# EAGLE design opamp_cc_load (EAGLE 7.6.0)
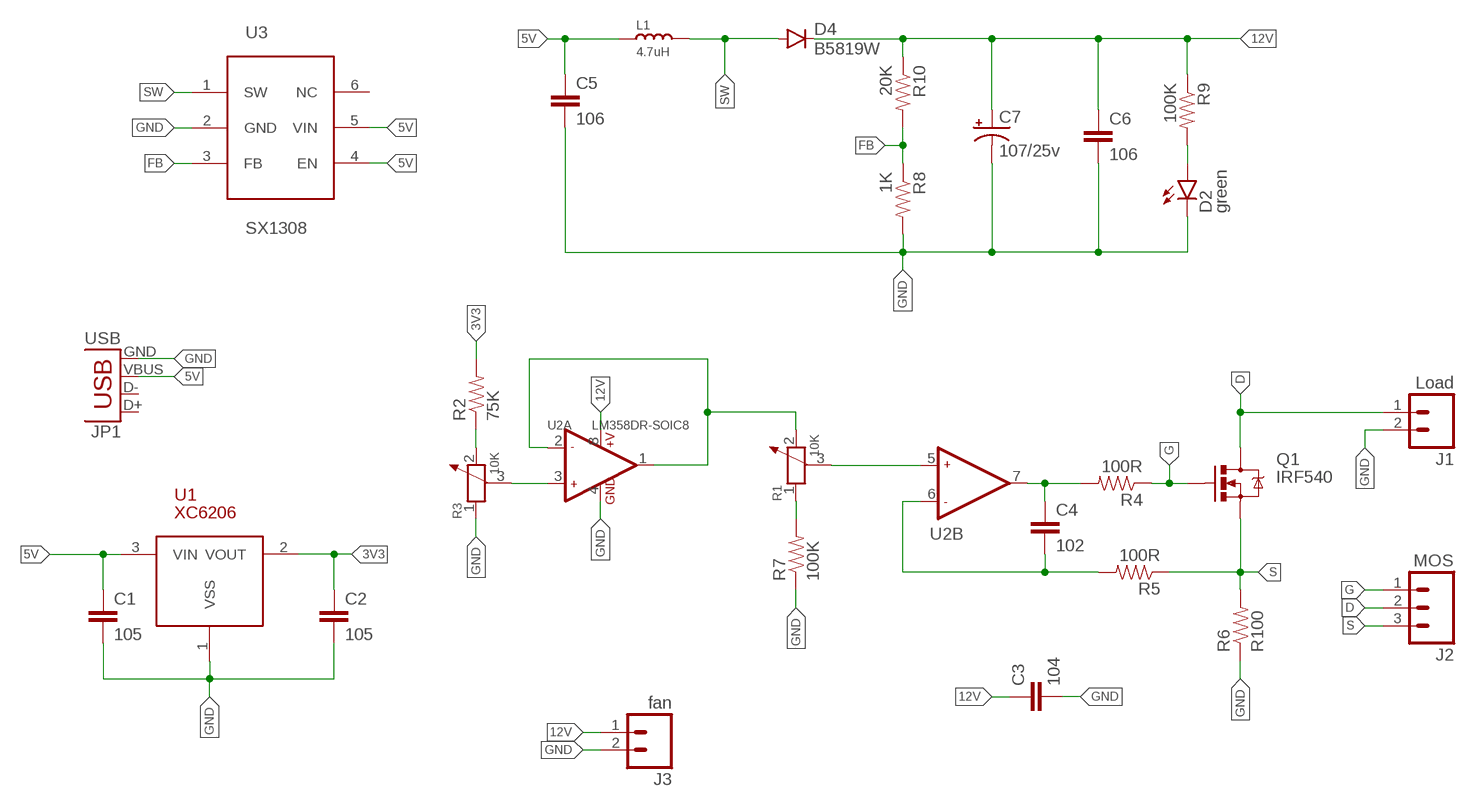
[diagram p0: schematic, sheet 1]

## Parts
C1  105  CAP0603-CAP  [0603-CAP]
C2  105  CAP0603-CAP  [0603-CAP]
C3  104  CAP0603-CAP  [0603-CAP]
C4  102  CAP0603-CAP  [0603-CAP]
C5  106  CAP1206  [1206]
C6  106  CAP1206  [1206]
C7  107/25v  CAP_POLPTH1  [CPOL-RADIAL-100UF-25V]
D2  green  LED-SEEED-0603  [LED-0603-SEEED]
D4  B5819W  DIODESOD123  [SOD-123]
J1  Load  M025MM  [SCREWTERMINAL-5MM-2]
J2  MOS  M03-SCREW-5MM  [SCREWTERMINAL-5MM-3]
J3  fan  M021X02_NO_SILK  [1X02_NO_SILK]
JP1  USB  [MICROUSB-U-F-M5DD-Y-1]
L1  4.7uH  SMD-INDUCTOR-200UH-20%(2P-5X5MM)  [SMD-2P-5.0X5.0X2.0MM]
Q1  IRF540  MOSFET-NCHANNELFQP30N06L  [TO220V]
R1  10K  DIP-VR-TOP-ADJ-10K-3362P(3P-7.0X7.0X5.0MM)  [ADJR3-7.0X7.0X5.0MM]
R2  75K  RESISTOR0603  [0603-RES]
R3  10K  DIP-VR-TOP-ADJ-10K-3362P(3P-7.0X7.0X5.0MM)  [ADJR3-7.0X7.0X5.0MM]
R4  100R  RESISTOR0603  [0603-RES]
R5  100R  RESISTOR0603  [0603-RES]
R6  R100  RESISTOR2512  [R2512]
R7  100K  RESISTOR0603  [0603-RES]
R8  1K  RESISTOR0603  [0603-RES]
R9  100K  RESISTOR0603  [0603-RES]
R10  20K  RESISTOR0603  [0603-RES]
U1  XC6206  [SOT23-3]
U2  LM358DR-SOIC8  AMPLIFIER-LM358DR(SOIC8)  [SOIC8-1.27-5X4MM]
U3  SX1308  [SOT23-6]

## Nets
3V3: C2.1 R2.2 U1.2(VOUT)
5V: C1.1 C5.1 JP1.VBUS L1.1 U1.3(VIN) U3.4(EN) U3.5(VIN)
12V: C3.1 C6.1 C7.1(+) D4.C J3.1 R9.1 R10.1 U2.8(A:+V)
D: J1.1 J2.2 Q1.2(D)
FB: R8.1 R10.2 U3.3(FB)
G: J2.1 Q1.1(G) R4.1
GND: C1.2 C2.2 C3.2 C5.2 C6.2 C7.2(-) D2.-(C) J1.2 J3.2 JP1.GND R3.1 R6.1 R7.1 R8.2 U1.1(VSS) U2.4(A:GND) U3.2(GND)
N$1: R3.3 U2.3(A:+IN1)
N$2: R1.2 U2.1(A:OUT1) U2.2(A:-IN1)
N$3: C4.1 R4.2 U2.7(B:OUT2)
N$4: D2.+(A) R9.2
N$5: R2.1 R3.2
N$6: C4.2 R5.2 U2.6(B:-IN2)
N$7: R1.3 U2.5(B:+IN2)
N$9: R1.1 R7.2
S: J2.3 Q1.3(S) R5.1 R6.2
SW: D4.A L1.2 U3.1(SW)
Unconnected: JP1.D+ JP1.D- U3.6(NC)

## Library data of the parts
C1-C6 = z_jlc_smt:CAP: Capacitor Standard 0603 ceramic capacitor, and 0.1" leaded capacitor.
C7 = z_jlc_smt:CAP_POL: Capacitor Polarized These are standard SMD and PTH capacitors. Normally 10uF, 47uF, and 100uF in electrolytic and tantalum varieties. Always verify the external diameter of the through hole cap, it varies with capacity, voltage, and manufacturer. The EIA devices should be standard.
D2 = z_jlc_smt:LED: LEDs Standard schematic elements and footprints for 5mm, 3mm, 1206, and 0603 sized LEDs. 5mm - Spark Fun Electronics SKU : COM-00529 (and others)
D4 = z_jlc_smt:DIODE: Diode These are standard reverse protection diodes and small signal diodes. SMA package can handle up to about 1A. SOD-323 can handle about 200mA. What the SOD-323 package when ordering, there are some mfgs out there that are 5-pin packages.
J1 = SparkFun-Connectors:M02: Standard 2-pin 0.1" header. Use with - straight break away headers ( PRT-00116) - right angle break away headers (PRT-00553) - swiss pins (PRT-00743) - machine pins (PRT-00117) - female headers (PRT-00115) Molex polarized connector foot print use with: PRT-08233 with associated crimp pins and housings. 2.54_SCREWTERM for use with PRT-10571. 3.5mm Screw Terminal footprints for PRT-08084 5mm Screw Terminal footprints for use with PRT-08432; STOREFRONT_ID: PRT-08432
J2 = SparkFun-Connectors:M03: Header 3 Standard 3-pin 0.1" header. Use with straight break away headers (SKU : PRT-00116), right angle break away headers (PRT-00553), swiss pins (PRT-00743), machine pins (PRT-00117), and female headers (PRT-00115). Molex polarized connector foot print use with SKU : PRT-08232 with associated crimp pins and housings.; STOREFRONT_ID: PRT-08433
J3 = SparkFun-Connectors:M02: Standard 2-pin 0.1" header. Use with - straight break away headers ( PRT-00116) - right angle break away headers (PRT-00553) - swiss pins (PRT-00743) - machine pins (PRT-00117) - female headers (PRT-00115) Molex polarized connector foot print use with: PRT-08233 with associated crimp pins and housings. 2.54_SCREWTERM for use with PRT-10571. 3.5mm Screw Terminal footprints for PRT-08084 5mm Screw Terminal footprints for use with PRT-08432
JP1 = xmgu2008:USB: USB Connectors USB-B-PTH is fully proven SKU : PRT-00139/CONN-08278 USB-miniB is fully proven SKU : PRT-00587 USB-A-PCB is untested. USB-A-H is throughly reviewed, but untested. Spark Fun Electronics SKU : PRT-00437 USB-B-SMT is throughly reviewed, but untested. Needs silkscreen touching up. USB-A-S has not been used/tested USB-MB-H has not been used/tested USB-MICROB has been used. CONN-09505
L1 = Seeed-OPL-Inductor:SMD-INDUCTOR-200UH-20%(2P-5X5MM): 303010140; MPN: SWPA5020S220MT; VALUE: 200UH
Q1 = xmgu2008:MOSFET-NCHANNEL: Common NMOSFET Parts MFG P/N Store ID Prod ID FDD8780 TRANS-09984 SI7820DN TRANS-11055 FDS6630A IC-08089 2N7002PW TRANS-11151 FQP30N06L COM-10213 TRANS-10060 BSS123LT1G TRANS-08345 BSS138 TRANS-00830 BS170 2N7000; PROD_ID: TRANS-10060
R1 R3 = xmgu2008:DIP-VR-TOP-ADJ-10K-3362P(3P-7.0X7.0X5.0MM): 301040009; MPN: SX3362P
R2 R4-R10 = z_jlc_smt:RESISTOR: Resistor Basic schematic elements and footprints for 0603, 1206, and PTH resistors.
U1 = z_jlc_smt:XC6206
U2 = Seeed-OPL-ic:AMPLIFIER-LM358DR(SOIC8): 310020021; MPN: LM358DR
U3 = xmgu2008:SX1308

## Board
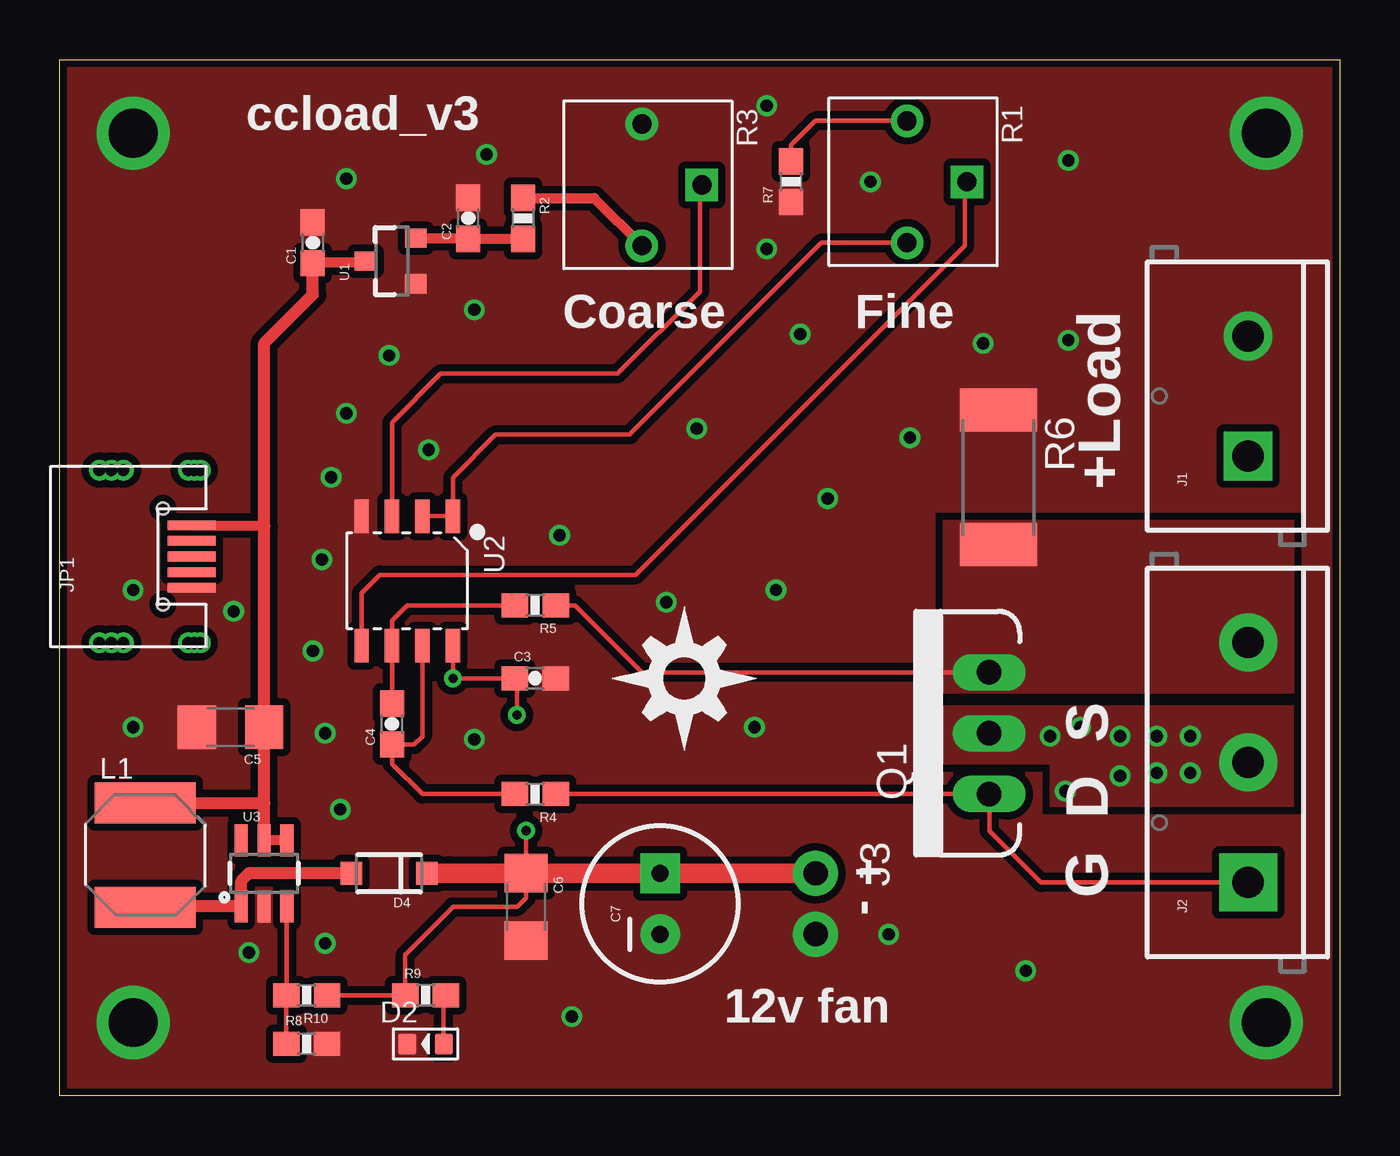
[diagram p1: board, top side]
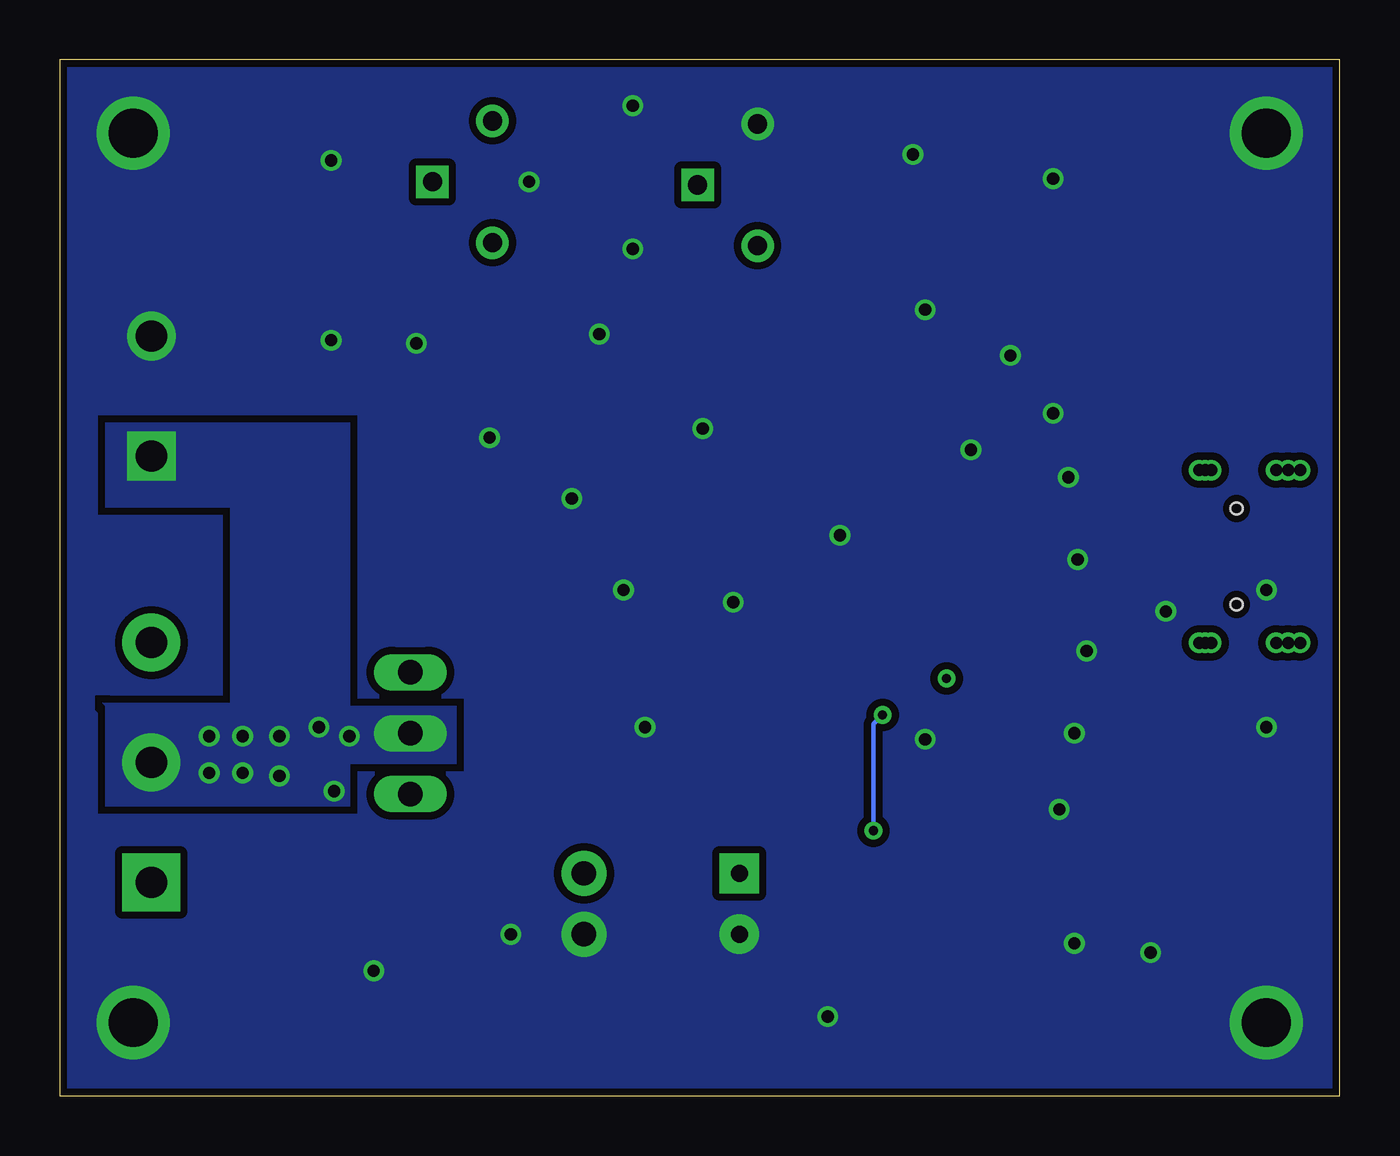
[diagram p2: board, bottom side, seen from below]

Size 53.34 x 43.18 mm. Coordinates in mm from the lower left corner, seen from the top.
Outline: 0,0 0,43.18 53.34,43.18 53.34,0 0,0
Copper layers (1*16): Top 0.035mm / dielectric 1.5mm / Bottom 0.035mm
Design rules "SparkFun-2-layer-TIGHT": minimum track width 7mil, minimum drill 15mil, track to track 7mil, track to pad 7mil, pad to pad 7mil, via to via 7mil, smd to smd 7mil, copper to edge 7mil, drill to drill 7mil, minimum pad ring 7mil, minimum via ring 7mil, stop-mask expansion 4mil, vias tented up to drill 20mil, thermal gap 10mil

### Footprints (pad centres in the part's own frame; a part is rotated, then mirrored left to right if it is on the bottom)
0603-CAP = smd 1.1 x 1: 1 -0.85,0; 2 0.85,0
1206 = smd 1.6 x 1.8: 1 -1.4,0; 2 1.4,0
CPOL-RADIAL-100UF-25V = drill 0.7 pad 1.651 square: 1 1.27,0 | drill 0.7 pad 1.651: 2 -1.27,0
LED-0603-SEEED = smd 0.762 x 0.889: + 0.762,0; - -0.762,0
SOD-123 = smd 0.9 x 0.95: A 1.575,0; C -1.575,0
SCREWTERMINAL-5MM-2 = drill 1.3 pad 2.032 square: 1 0,0 | drill 1.3 pad 2.032: 2 5,0
SCREWTERMINAL-5MM-3 = drill 1.3 pad 2.413 square: 1 0,0 | drill 1.3 pad 2.413: 2 5,0; 3 10,0
1X02_NO_SILK = drill 1.016 pad 1.88: 1 0,0; 2 2.54,0
MICROUSB-U-F-M5DD-Y-1 = drill 0.5: 6_1 3.6,0.25; 6_2 3.6,0.5; 6_3 3.6,0.75; 7_1 3.6,3.45; 7_2 3.6,3.95; 7_3 3.6,4.45; 8_1 -3.6,4.45; 8_2 -3.6,3.95; 8_3 -3.6,3.45; 9_1 -3.6,0.75; 9_2 -3.6,0.5; 9_3 -3.6,0.25 | smd 0.4 x 2: D+ 0,0.6; D- 0.65,0.6; GND -1.3,0.6; ID -0.65,0.6; VBUS 1.3,0.6 | hole 0.5: -2,1.8; 2,1.8
SMD-2P-5.0X5.0X2.0MM = smd 4.2 x 1.7: 1 0,2.175; 2 0,-2.175
TO220V = drill 1.016 long: 1 -2.54,0; 2 0,0; 3 2.54,0
ADJR3-7.0X7.0X5.0MM = drill 0.8 pad 1.35: 1 -2.54,-0.25; 2 2.54,-0.25 | drill 0.8 pad 1.35 square: 3 0,2.25
0603-RES = smd 1.1 x 1: 1 -0.85,0; 2 0.85,0
R2512 = smd 1.8 x 3.2: 1 -2.8,0; 2 2.8,0
SOT23-3 = smd 0.9 x 0.8: 1 1,-0.95; 2 1,0.95; 3 -1.1,0
SOIC8-1.27-5X4MM = smd 0.6 x 1.4: 1 -1.905,-2.7; 2 -0.635,-2.7; 3 0.635,-2.7; 4 1.905,-2.7; 5 1.905,2.7; 6 0.635,2.7; 7 -0.635,2.7; 8 -1.905,2.7
SOT23-6 = smd 0.55 x 1.35: 1 -0.95,-1.375; 2 0,-1.375; 3 0.95,-1.375; 4 0.95,1.375; 5 0,1.375; 6 -0.95,1.375

### Placement (x,y rotation side)
C1  10.54,35.56 90 top
C2  17.02,36.58 90 top
C3  19.81,17.4 0 top
C4  13.84,15.49 90 top
C5  7.11,15.37 180 top
C6  19.43,7.87 270 top
C7  25.02,8 90 top
D2  15.24,2.16 0 top
D4  13.72,9.27 180 top
J1  49.53,26.67 90 top
J2  49.53,8.89 90 top
J3  31.5,9.27 270 top
JP1  6.1,22.48 90 top
L1  3.56,10.03 0 top
Q1  38.73,15.11 90 top
R1  35.56,38.1 270 top
R2  19.3,36.58 270 top
R3  24.51,37.97 270 top
R4  19.81,12.57 180 top
R5  19.81,20.45 180 top
R6  39.12,25.78 270 top
R7  30.48,38.1 90 top
R8  10.29,2.16 0 top
R9  15.24,4.19 0 top
R10  10.29,4.19 180 top
U1  13.84,34.8 0 top
U2  14.48,21.46 180 top
U3  8.51,9.27 0 top
U$1  [DIYNOVA_LOGO]  22.99,14.35 0 top

### Tracks (layer width: path | path; a pad name or v marks a point on that pad's centre or on a via)
3V3
  Top 0.406: U1.2 17,35.75 C2.1 R2.2
5V
  Top 0.178: 12.67,34.73 U1.3
  Top 0.406: U3.4 U3.5 | JP1.VBUS 8.48,23.78 8.51,23.75 | 12.67,34.73 10.56,34.73 C1.1
  Top 0.508: L1.1 8.5,12.21 8.51,12.19 | U3.5 8.51,12.19 | 8.51,12.19 C5.1 8.51,23.75 8.51,31.37 10.54,33.4 C1.1
12V  (via drill 0.38)
  Top 0.178: U2.8 v16.38,17.4 C3.1 19.05,17.31 v19.05,15.88 | 16.38,9.4 16.26,9.27 | R10.1 R9.1 14.39,5.88 16.38,7.87 19.05,7.87 19.43,8.26 C6.1 v19.43,11.05 | 17.91,9.14 18.03,9.27
  Top 0.813: D4.C 16.26,9.27 18.03,9.27 C6.1 C7.1 J3.1
  Bottom 0.178: v19.43,11.05 19.43,15.49 v19.05,15.88
D  (via drill 0.51)
  other vias: 47.12,14.99 47.12,13.46 45.72,13.46 45.72,14.99 44.2,14.99 44.2,13.34 42.55,15.37 41.27,14.99 41.91,12.7
  pour Top (isolate 0.305, no thermals): 36.83,16.26 36.83,13.84 41.27,13.84 41.27,12.06 51.44,12.06 51.44,16.26
  pour Bottom (isolate 0.305, no thermals): 51.44,24.51 51.44,28.07 41.27,28.07 41.27,16.26 36.83,16.26 36.83,13.84 41.27,13.84 41.27,12.06 51.44,12.06 51.44,16.26 51.56,16.38 46.23,16.38 46.23,24.51
FB
  Top 0.178: U3.3 9.46,4.21 R10.2 R8.1
G
  Top 0.178: R4.1 Q1.1 38.73,11.05 40.89,8.89 J2.1
GND  (via drill 0.51, 2.03)
  other vias: 17.27,14.86 17.78,39.24 17.27,32.77 42.04,31.5 38.48,31.37 35.43,27.43 32,24.89 29.84,21.08 20.83,23.37 25.27,20.57 28.96,15.37 34.54,6.73 21.34,3.3 7.24,20.19 3.05,40.13 3.05,3.05 50.29,40.13 50.29,3.05 26.54,27.81 3.05,21.08 7.87,5.97 11.05,6.35 10.92,22.35 11.3,25.78 11.94,28.45 13.72,30.86 10.54,18.54 11.05,15.11 15.37,26.92 30.86,31.75 29.46,35.31 33.78,38.1 29.46,41.27 42.04,38.99 40.26,5.21 11.68,11.94 3.05,15.37 11.94,38.23
  pour Top (isolate 0.305, rank 3, no thermals): 0,0 0,43.18 53.34,43.18 53.34,0
  pour Bottom (isolate 0.305, rank 3, no thermals): 0,0 0,43.18 53.34,43.18 53.34,0
N$1
  Top 0.178: U2.3 13.84,28.07 15.88,30.1 23.24,30.1 26.67,33.53 26.67,37.88 R3.3
N$2
  Top 0.178: U2.2 U2.1 16.38,25.78 18.16,27.56 23.75,27.56 31.75,35.56 R1.2
N$3
  Top 0.178: R4.2 15.11,12.57 13.84,13.84 C4.1 14.77,14.64 15.11,14.99 U2.7
N$4
  Top 0.178: D2.+ 16,4.1 R9.2
N$5
  Top 0.406: R2.1 22.27,37.43 R3.2
N$6
  Top 0.178: C4.2 U2.6 13.84,19.81 14.48,20.45 R5.2
N$7
  Top 0.178: U2.5 12.57,20.95 13.34,21.72 24,21.72 37.72,35.43 37.72,38.01 R1.3
N$9
  Top 0.178: R1.1 31.5,40.64 30.48,39.62 R7.2
S
  Top 0.178: Q1.3 24.26,17.65 21.46,20.45 R5.1
  pour Top (isolate 0.305, no thermals): 36.83,16.76 36.83,24 51.44,24 51.44,16.76
SW
  Top 0.508: L1.2 3.59,7.9 U3.1 7.56,8.96 7.87,9.27 D4.A

### Text on the board
tPlace: ccload_v3 | Coarse | Fine | +Load | + - | G D S | 12v fan